# Altium schematic sheet DRV8711EVM.SchDoc
size OrCAD B; PageSetup: Record=PageOptions|CenterHorizontal=True|CenterVertical=True|PrintScale=0.54|XCorrection=1.00|YCorrection=1.00|PrintKind=0|BorderSize=5000000|LeftOffset=0|BottomOffset=0|Orientation=2|PaperLength=1000|PaperWidth=1000|Scale=100|PaperSource=15|PrintQuality=600|MediaType=1|DitherType=10|PaperKind=Letter|PrintScaleMode=1
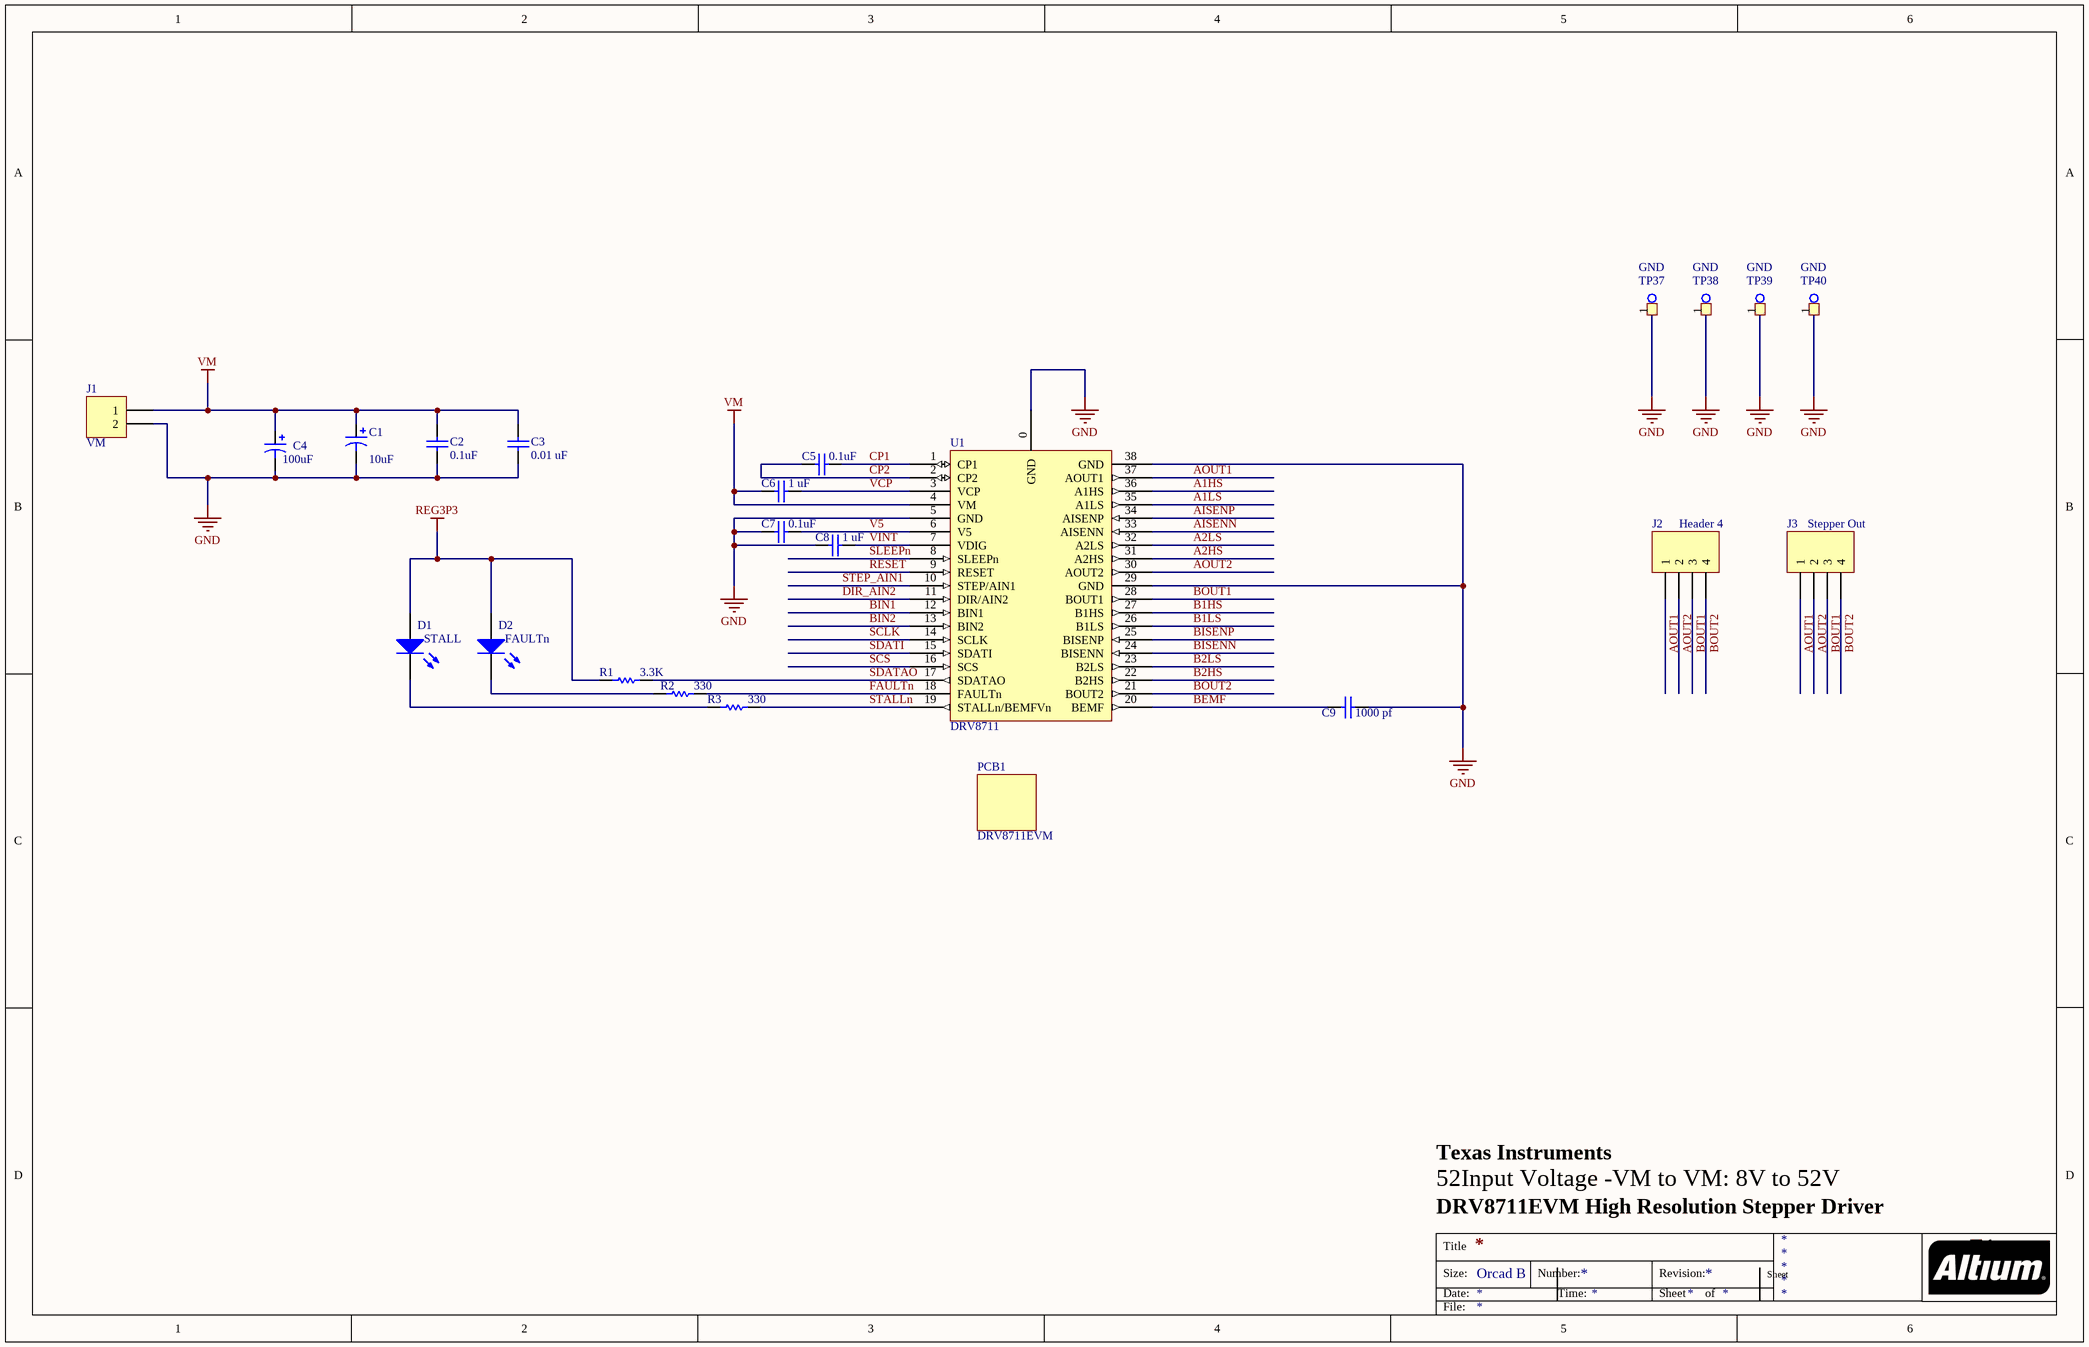
[diagram p0: DRV8711EVM.SchDoc]

## Parts
C1  value 10uF  [RB .1/.250 - SML]
C2  value 0.1uF  [0603-SMT]
C3  value 0.01 uF  [0603-SMT]
C4  value 100uF  [RB 5.0mm/12.5mm_NoPost]
C5  value 0.1uF  [0603-SMT]
C6  value 1 uF  [1206]
C7  value 0.1uF  [0603-SMT]
C8  value 1 uF  [0603-SMT]
C9  value 1000 pf  [0603-SMT]
D1  STALL  [1206_LED]
D2  FAULTn  [1206_LED]
J1  VM  [PWR_CONN2]
J2  Header 4  [PWR_CONN4]
J3  Stepper Out  [HDR1X4]
PCB1  DRV8711EVM  [TI_LOGO]
R1  value 3.3K  [0603-SMT]
R2  330  [0603-SMT]
R3  330  [0603-SMT]
TP37  GND  [TEST POINT 0.052]
TP38  GND  [TEST POINT 0.052]
TP39  GND  [TEST POINT 0.052]
TP40  GND  [TEST POINT 0.052]
U1  DRV8711  [DCP38 SMT]

## Nets
GND: C1.2 C2.2 C3.2 C4.2 C7.2 C8.2 C9.2 J1.2 TP37.1 TP38.1 TP39.1 TP40.1 U1.0(GND) U1.5(GND) U1.29(GND) U1.38(GND)
REG3P3: D1.1(A) D2.1(A) R1.2
VM: C1.1 C2.1 C3.1 C4.1 C6.2 J1.1 U1.4(VM)
A1HS: U1.36(A1HS)
A1LS: U1.35(A1LS)
A2HS: U1.31(A2HS)
A2LS: U1.32(A2LS)
AISENN: U1.33(AISENN)
AISENP: U1.34(AISENP)
AOUT1: J2.1 J3.1 U1.37(AOUT1)
AOUT2: J2.2 J3.2 U1.30(AOUT2)
B1HS: U1.27(B1HS)
B1LS: U1.26(B1LS)
B2HS: U1.22(B2HS)
B2LS: U1.23(B2LS)
BEMF: C9.1 U1.20(BEMF)
BIN1: U1.12(BIN1)
BIN2: U1.13(BIN2)
BISENN: U1.24(BISENN)
BISENP: U1.25(BISENP)
BOUT1: J2.3 J3.3 U1.28(BOUT1)
BOUT2: J2.4 J3.4 U1.21(BOUT2)
CP1: C5.1 U1.1(CP1)
CP2: C5.2 U1.2(CP2)
DIR_AIN2: U1.11(DIR/AIN2)
FAULTn: R2.1 U1.18(FAULTn)
RESET: U1.9(RESET)
SCLK: U1.14(SCLK)
SCS: U1.16(SCS)
SDATAO: R1.1 U1.17(SDATAO)
SDATI: U1.15(SDATI)
SLEEPn: U1.8(SLEEPn)
STALLn: R3.1 U1.19(STALLn/BEMFVn)
STEP_AIN1: U1.10(STEP/AIN1)
V5: C7.1 U1.6(V5)
VCP: C6.1 U1.3(VCP)
VINT: C8.1 U1.7(VDIG)
NetD1_2: D1.2(K) R3.2
NetD2_2: D2.2(K) R2.2

## Notes on the sheet
- Texas Instruments
- DRV8711EVM High Resolution Stepper Driver
- 52Input Voltage -VM to VM: 8V to 52V
- Sheet
- E1
- Title
- Size:
- Date:
- Orcad B
- Number:
- Time:
- Revision:
- of
- File:

## Library data of the parts
C1 = Cap Pol1: CAP ALUM 10UF 25V 20% RADIAL; MFG Part Number: UVR1E100MDD; Manufacturer: Nichicon; DK Part Number: 493-1057-ND
C2 C5 = Cap: Capacitor; Manufacturer: TDK; MFG Part Number: C1608X7S2A104M; DK Part Number: 445-5202-1-ND
  C5: Revision: July-2002: Re-released for DXP Platform.
C3 = Cap: Capacitor; Manufacturer: TDK; MFG Part Number: C1608X7R2A103K; DK Part Number: 445-1304-1-ND
C4 = Cap Pol1: CAP ALUM 100UF 100V 20% RADIAL; MFG Part Number: ECA-2AM101; Manufacturer: Panasonic; DK Part Number: P5313-ND
C6 = Cap: Capacitor; Manufacturer: TDK; MFG Part Number: C3216X7R1H105K; DK Part Number: 445-1423-1-ND
C7 = Cap: Capacitor; Manufacturer: Yageo; MFG Part Number: CC0603ZRY5V9BB104; DK Part Number: 311-1343-1-ND; Revision: July-2002: Re-released for DXP Platform.
C8 = Cap: Capacitor; Manufacturer: TDK; MFG Part Number: C1608Y5V1A105Z; DK Part Number: 445-1328-1-ND
C9 = Cap: Capacitor; Manufacturer: Yageo; MFG Part Number: CC0603JRNPO8BN102; DK Part Number: 311-1342-1-ND
D1 D2 = LED2: LED RED FACE UP 1206; DK Part Number: P11532CT-ND; Manufacturer: Panasonic; MFG Part Number: LNJ211R82RA; Value: Red LED
J1 = Header 2: TERM BLOCK 5.08MM VERT 2POS PCB; Manufacturer: On Shore Technologies; MFG Part Number: OSTTA024163; DK Part Number: ED2580-ND; Value: Connector
J2 = Header 4: TERM BLOCK 5.08MM VERT 4POS PCB; Manufacturer: On Shore Technologies; MFG Part Number: OSTTA044163; DK Part Number: ED2582-ND; Value: Terminal Block
J3 = Header 4: CONN HEADER .100 SNGL STR 4POS; DK Part Number: 929647-09-04-ND; Manufacturer: 3M; MFG Part Number: 929647-09-04-I; Value: 4 Pos Header
PCB1 = TI_LOGO: Bare Board; DK Part Number: Board; Manufacturer: Board; MFG Part Number: Board; Value: Board
R1 = Res1: RES 3.3K OHM 1/10W 5% 0603 SMD; Manufacturer: Panasonic; MFG Part Number: ERJ-3GEYJ332V; DK Part Number: P3.3KGCT-ND; Revision: July-2002: Re-released for DXP Platform.
R2 R3 = Res1: Resistor; MFG Part Number: RC0603JR-07330RL; Manufacturer: Yageo; DK Part Number: 311-330GRCT-ND; Value: 330
TP37-TP40 = TEST POINT: TEST POINT PC COMPACT .063"D BLK; Manufacturer: Keystone; MFG Part Number: 5006; DK Part Number: 5006K-ND; Value: BLACK
U1 = DRV8711: Pre Driver Stepper Motor Controller; Manufacturer: Texas Instruments; MFG Part Number: DRV8711DCP; DK Part Number: N/A; Value: Driver